# Altium project STMFORASIC.PrjPcb
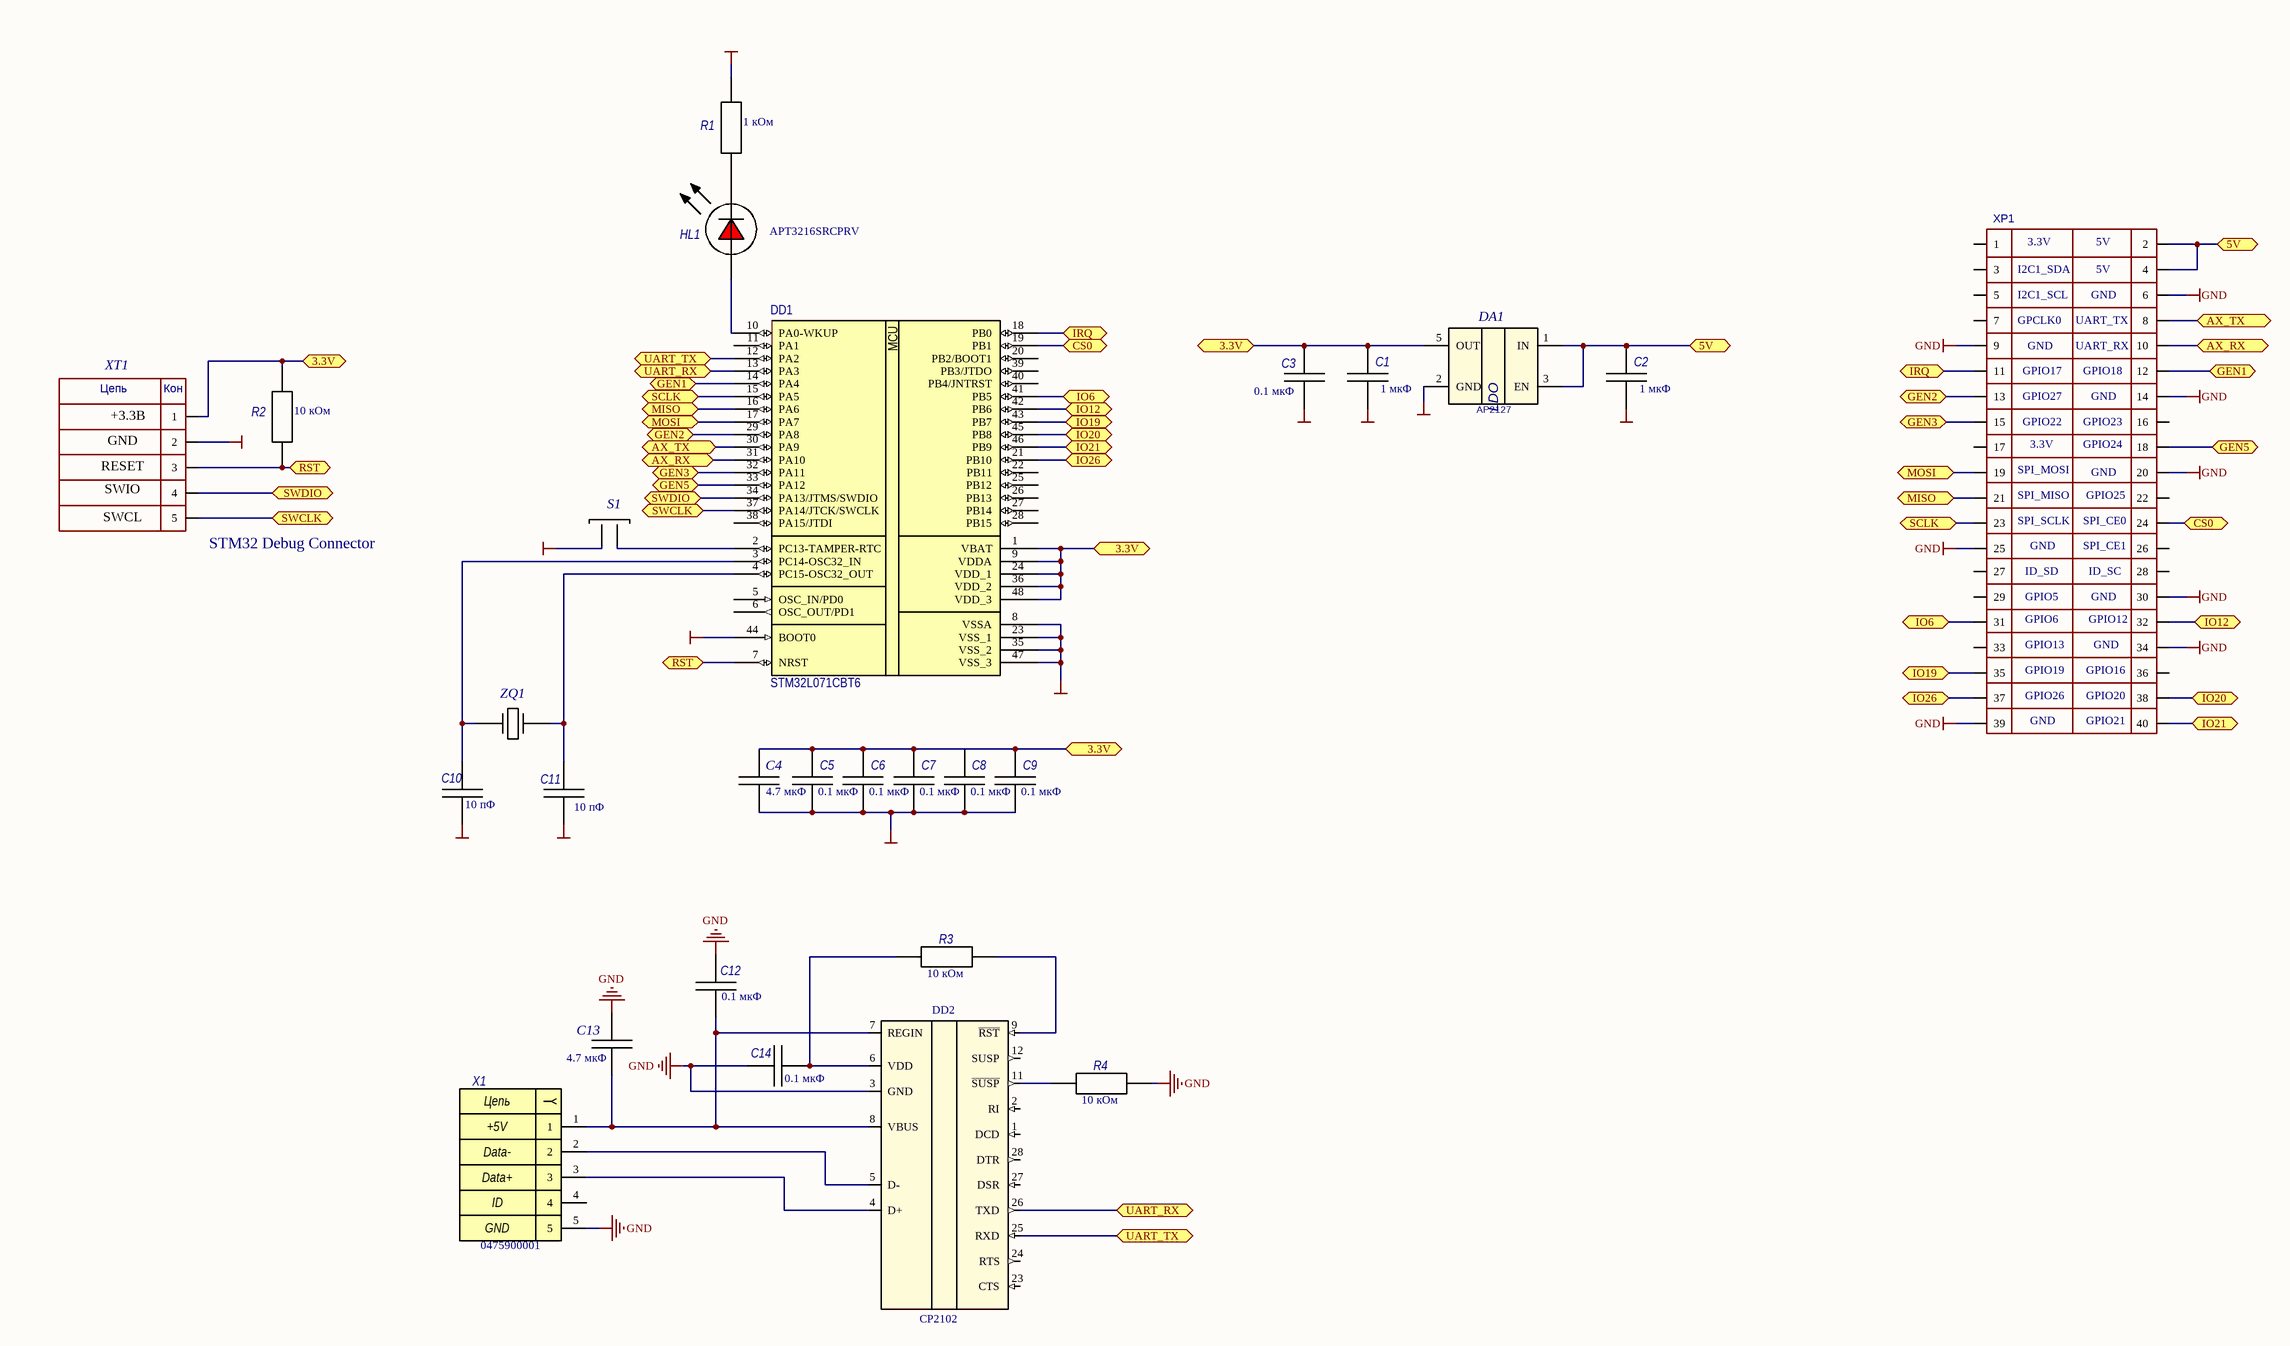
[diagram p0: STMFORASIC.SchDoc]
1 sheet, 27 parts. Net scope: flat (ports and power ports of the same name join across sheets).
Board file: STMFORASIC.PcbDoc

## Sheet STMFORASIC.SchDoc
size A2

### Parts
C1  value 1 мкФ  [CAP_0603]
C2  value 1 мкФ  [CAP_0603]
C3  value 0.1 мкФ  [CAP_0603]
C4  value 4.7 мкФ  [CAP_0603]
C5  value 0.1 мкФ  [CAP_0603]
C6  value 0.1 мкФ  [CAP_0603]
C7  value 0.1 мкФ  [CAP_0603]
C8  value 0.1 мкФ  [CAP_0603]
C9  value 0.1 мкФ  [CAP_0603]
C10  value 10 пФ  [CAP_0603]
C11  value 10 пФ  [CAP_0603]
C12  value 0.1 мкФ  [CAP_0603]
C13  value 4.7 мкФ  [CAP_0603]
C14  value 0.1 мкФ  [CAP_0603]
DA1  AP2127  [SOT23-5AN]
DD1  STM32L071CBT6  [TSQFP50P900X900X160-48N]
DD2  CP2102  [QFN28]
HL1  APT3216SRCPRV  [LED_1206_RED_Bottom]
R1  value 1 кОм  [RES_0603]  (hidden comment: STD_RES)
R2  value 10 кОм  [RES_0603]  (hidden comment: STD_RES)
R3  value 10 кОм  [RES_0603]  (hidden comment: STD_RES)
R4  value 10 кОм  [RES_0603]  (hidden comment: STD_RES)
S1  SMD Button  [FSM_Button]  (value not drawn)  (no BOM)
X1  0475900001  [0475900001]
XP1  PBD-40  [PBD-40]  (value not drawn)
XT1  PLS-5  [HDR1X5]  (value not drawn)
ZQ1  KX-327NHT 32.768 kHz  [KX-327NHT]  (value not drawn)

### Ports
3.3V, 5V, AX_RX, AX_TX, CS0, GEN1, GEN2, GEN3, GEN5, IO6, IO12, IO19, IO20, IO21, IO26, IRQ, MISO, MOSI, RST, SCLK, SWCLK, SWDIO, UART_RX, UART_TX

### Nets
GND: C1.2 C2.2 C3.1 C4.2 C5.2 C6.2 C7.2 C8.2 C9.2 C10.2 C11.2 C12.1 C13.1 C14.1 DA1.2(GND) DD1.8(VSSA) DD1.23(VSS_1) DD1.35(VSS_2) DD1.44(BOOT0) DD1.47(VSS_3) DD2.3(GND) DD2.29 R1.2 R4.1 S1.2 X1.5 XP1.6 XP1.9 XP1.14 XP1.20 XP1.25 XP1.30 XP1.34 XP1.39 XT1.2
NetC1_1: C1.1 C3.2 C4.1 C5.1 C6.1 C7.1 C8.1 C9.1 DA1.5(OUT) DD1.1(VBAT) DD1.9(VDDA) DD1.24(VDD_1) DD1.36(VDD_2) DD1.48(VDD_3) R2.1 XT1.1 ; port 3.3V
NetC2_1: C2.1 DA1.1(IN) DA1.3(EN) XP1.2 XP1.4 ; port 5V
NetC10_1: C10.1 DD1.3(PC14-OSC32_IN) ZQ1.2
NetC11_1: C11.1 DD1.4(PC15-OSC32_OUT) ZQ1.1
NetC12_2: C12.2 C13.2 DD2.7(REGIN) DD2.8(VBUS) X1.1
NetC14_2: C14.2 DD2.6(VDD) R3.2
NetDD1_2: DD1.2(PC13-TAMPER-RTC) S1.1
NetDD1_7: DD1.7(NRST) R2.2 XT1.3 ; port RST
NetDD1_10: DD1.10(PA0-WKUP) HL1.1(A)
NetDD1_12: DD1.12(PA2) DD2.25(RXD) ; port UART_TX
NetDD1_13: DD1.13(PA3) DD2.26(TXD) ; port UART_RX
NetDD1_14: DD1.14(PA4) XP1.12 ; port GEN1
NetDD1_15: DD1.15(PA5) XP1.23 ; port SCLK
NetDD1_16: DD1.16(PA6) XP1.21 ; port MISO
NetDD1_17: DD1.17(PA7) XP1.19 ; port MOSI
NetDD1_18: DD1.18(PB0) XP1.11 ; port IRQ
NetDD1_19: DD1.19(PB1) XP1.24 ; port CS0
NetDD1_21: DD1.21(PB10) XP1.37 ; port IO26
NetDD1_29: DD1.29(PA8) XP1.13 ; port GEN2
NetDD1_30: DD1.30(PA9) XP1.8 ; port AX_TX
NetDD1_31: DD1.31(PA10) XP1.10 ; port AX_RX
NetDD1_32: DD1.32(PA11) XP1.15 ; port GEN3
NetDD1_33: DD1.33(PA12) XP1.18 ; port GEN5
NetDD1_34: DD1.34(PA13/JTMS/SWDIO) XT1.4 ; port SWDIO
NetDD1_37: DD1.37(PA14/JTCK/SWCLK) XT1.5 ; port SWCLK
NetDD1_41: DD1.41(PB5) XP1.31 ; port IO6
NetDD1_42: DD1.42(PB6) XP1.32 ; port IO12
NetDD1_43: DD1.43(PB7) XP1.35 ; port IO19
NetDD1_45: DD1.45(PB8) XP1.38 ; port IO20
NetDD1_46: DD1.46(PB9) XP1.40 ; port IO21
NetDD2_4: DD2.4(D+) X1.3
NetDD2_5: DD2.5(D-) X1.2
NetDD2_9: DD2.9(~{RST}) R3.1
NetDD2_11: DD2.11(~{SUSP}) R4.2
NetHL1_2: HL1.2(K) R1.1

Not connected (* = marked no-connect by the designer): DD1 5(OSC_IN/PD0) 6(OSC_OUT/PD1) 11(PA1) 20(PB2/BOOT1) 22(PB11) 25(PB12) 26(PB13) 27(PB14) 28(PB15) 38(PA15/JTDI) 39(PB3/JTDO) 40(PB4/JNTRST); DD2 1(DCD) 2(RI) 12(SUSP) 23(CTS) 24(RTS) 27(DSR) 28(DTR); X1 4; XP1 1 3 5 7 16 17 22 26 27 28 29 33 36

### Notes on the sheet
- (near XT1) RESET
- GND
- (near XT1) +3.3В
- SWCL
- SWIO
- (near XT1) STM32 Debug Connector
- (in symbol 0475900001) Цепь; +5V; Data-; Data+; ID; GND
- (in symbol AP2127) LDO
- (in symbol PBD-40) 3.3V; 5V; I2C1_SDA; I2C1_SCL; GND; GPCLK0; UART_TX; UART_RX; GPIO17; GPIO18; GPIO27; GPIO22; GPIO23; GPIO24; SPI_MOSI; SPI_MISO; GPIO25; SPI_SCLK; SPI_CE0; SPI_CE1; ID_SD; ID_SC; GPIO5; GPIO6; GPIO12; GPIO13; GPIO19; GPIO16; GPIO26; GPIO20; GPIO21
- (in symbol PLS-5pin) Цепь; Кон
- (in symbol STM32_LQFP48) MCU

### Library data of the parts
C1 C2 = CC0603KRX7R7BB105: Конденсатор CHIP-0603 1 мкФ 16 В 10% X7R; Manufacturer: YAGEO; ID: 68; Напряжение: 16 В; Температура: -55...+85°C; Autor: Цислав А.Н.; PartNumber: CC0603KRX7R7BB105; Type: CHIP-0603; Tolerance: 10%; Диэлектрик: X7R; Data: 09-05-2013
C3 C5-C9 C12 C14 = CC0603KRX7R7BB104: Конденсатор CHIP-0603 0.1 мкФ 16 В 10% X7R; Manufacturer: YAGEO; ID: 27; Напряжение: 16 В; Температура: -55...+85°C; Autor: Admin; PartNumber: CC0603KRX7R7BB104; Type: CHIP-0603; Tolerance: 10%; Диэлектрик: X7R; Data: 08-29-2013
C4 C13 = CC0603KRX5R6BB475: Конденсатор CHIP-0603 4.7 мкФ 10 В 10% X5R; Manufacturer: YAGEO; ID: 71; Напряжение: 10 В; Температура: -55...+85°C; Autor: Цислав А.Н.; PartNumber: CC0603KRX5R6BB475; Type: CHIP-0603; Tolerance: 10%; Диэлектрик: X5R; Data: 09-05-2013
C10 C11 = CL10C180JB8NNNC: Конденсатор CHIP-0603 10 пФ 50 В 5% NPO; PartNumber: CC0603JRNPO9BN100; Manufacturer: Samsung; ID: 182; Напряжение: 50 В; Температура: -55...+85°C; Autor: Admin; Type: CHIP-0603; Tolerance: 5%; Диэлектрик: NPO; Data: 05-16-2016
DA1 = AP2127: Comment_1: TPS61040
DD1 = STM32_LQFP48: IC MCU 32BIT 128KB FLASH 48LQFP; Manufacturer: STMicroelectronics; Core Processor: ARM® Cortex®-M0+; Core Size: 32-Bit; Speed: 32MHz; Connectivity: I²C, IrDA, SPI, UART/USART; Peripherals: Brown-out Detect/Reset, DMA, POR, PWM, WDT; Number of I/O: 37; Program Memory Size: 128KB (128K x 8); EEPROM Size: 6K x 8; RAM Size: 20K x 8; Voltage - Supply (Vcc/Vdd): 1.65 V ~ 3.6 V; Data Converters: A/D 13x12b; Oscillator Type: Internal; Part Number: STM32L071CBT6; Digi-Key Part Number: STM32L071CBT6-ND; Packaging: Tray; Series: STM32 L0; Part Status: Active; Program Memory Type: FLASH; Operating Temperature: -40°C ~ 85°C (TA); Package / Case: 48-LQFP; Supplier Device Package: 48-LQFP; ComponentLink1URL: http://www.st.com/content/ccc/resource/technical/document/datasheet/b5/24/80/11/51/59/47/f7/DM00141136.pdf/files/DM00141136.pdf/jcr:content/translations/en.DM00141136.pdf; ComponentLink1Description: Datasheet
DD2 = CP2102: IC USB-TO-UART BRIDGE 28VQFN; CP2102-GMR: PartNumber
HL1 = APT3216SRCPRV: Диод Kingbright 1.85 В 20 мА; ID: 34; Type: LED; U_direct: 1.85 В; Current: 20 мА; Температура: -40...+85°C; Autor: Admin; PartNumber: APT3216SRCPRV; Manufacturer: Kingbright; Data: 10-17-2016
R1 = RC0603FR-071K: Резистор CHIP-0603 1 кОм 1%; Manufacturer: YAGEO; Autor: Цислав А.Н.; ID: 121; ТКС: 100 ppm/K; Температура: -55...+85°C; PartNumber: RC0603FR-071K; Type: CHIP-0603; Tolerance: 1%; Data: 09-05-2013
R2-R4 = RC0603FR-0710K: Резистор CHIP-0603 10 кОм 1%; Manufacturer: YAGEO; Autor: Цислав А.Н.; ID: 169; ТКС: 100 ppm/K; Температура: -55...+85°C; PartNumber: RC0603FR-0710K; Type: CHIP-0603; Tolerance: 1%; Data: 09-05-2013
X1 = 0475900001: Разъем Molex USB; ID: 136; Contact: 5; Pitch: 0.65 мм; Current: 500 мА; Autor: Admin; PartNumber: 0475900001; Type: USB; Mounting: Поверхностный; Manufacturer: Molex; Data: 04-07-2016
XP1 = PBD-40: PartNumber: PLD-40
XT1 = PLS-5pin
ZQ1 = KX-327NHT 32.768 kHz: Микросхема Geyer  Quartz Crystal; ID: 120; Температура: -40...+85°C; Autor: Admin; PartNumber: KX-327NHT 32.768 kHz; Type: Clocks; Value: Quartz Crystal; Manufacturer: Geyer; Data: 02-12-2015